# Altium schematic sheet 03-Connectors.SchDoc
size A; DocumentNumber: 4; SheetNumber: 4; SheetTotal: 4
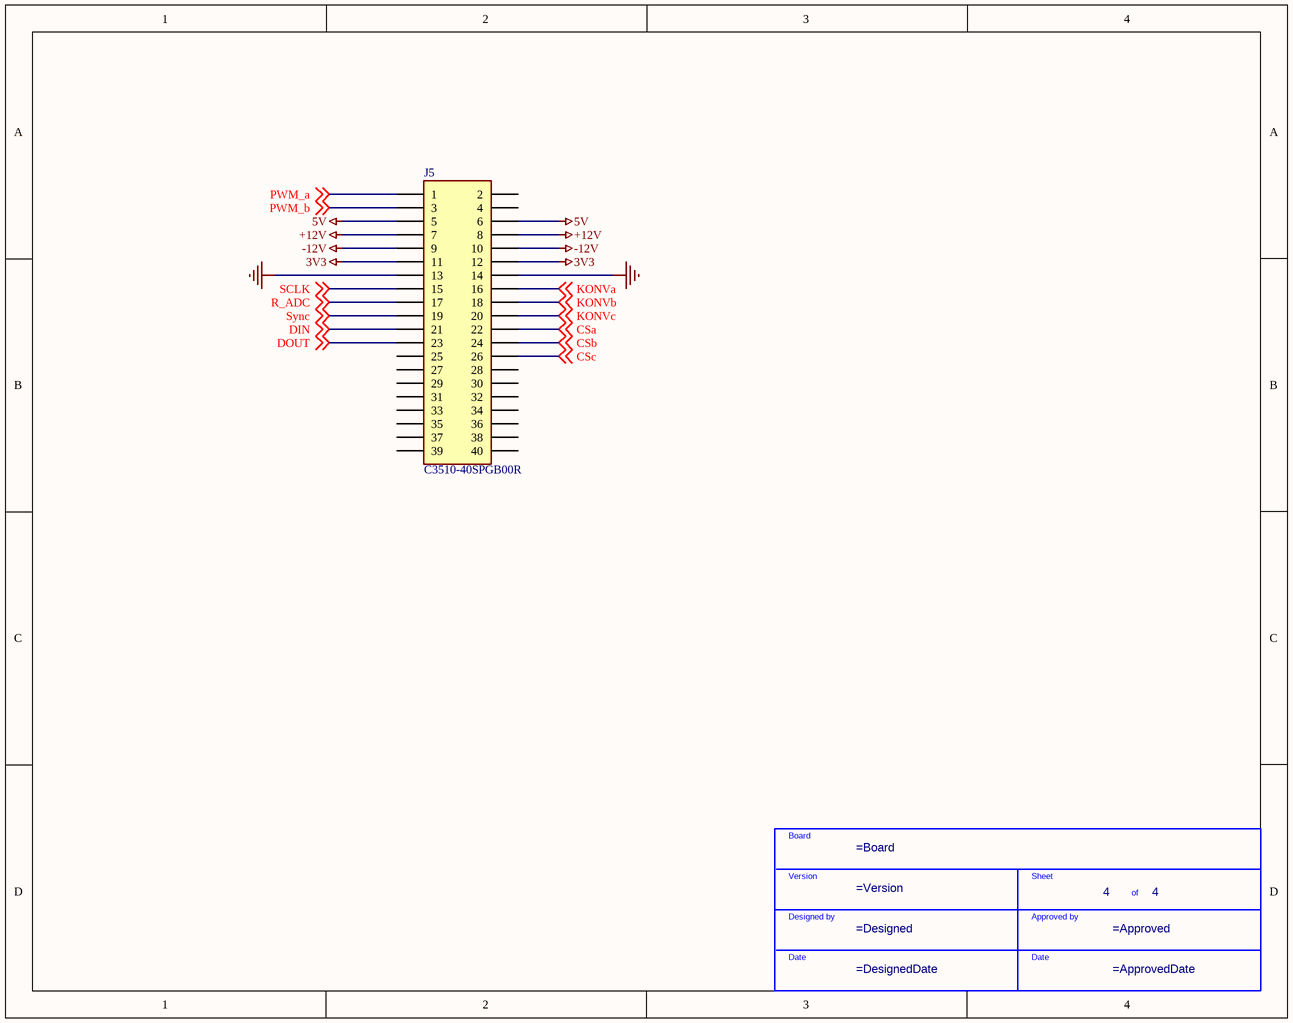
[diagram p0: 03-Connectors.SchDoc]

## Parts
J5  C3510-40SPGB00R  [CONN2X20_MOLEX]
STB  -  (value not drawn)  (graphical)

## Nets
3V3: J5.11 J5.12
5V: J5.5 J5.6
+12V: J5.7 J5.8
-12V: J5.9 J5.10
P_GND: J5.13 J5.14
CSa: J5.22 ; off-sheet CSa
CSb: J5.24 ; off-sheet CSb
CSc: J5.26 ; off-sheet CSc
DIN: J5.21 ; off-sheet DIN
DOUT: J5.23 ; off-sheet DOUT
KONVa: J5.16 ; off-sheet KONVa
KONVb: J5.18 ; off-sheet KONVb
KONVc: J5.20 ; off-sheet KONVc
PWM_a: J5.1 ; off-sheet PWM_a
PWM_b: J5.3 ; off-sheet PWM_b
R_ADC: J5.17 ; off-sheet R_ADC
SCLK: J5.15 ; off-sheet SCLK
Sync: J5.19 ; off-sheet Sync

Not connected (* = marked no-connect by the designer): J5 2 4 25 27 28 29 30 31 32 33 34 35 36 37 38 39 40

## Notes on the sheet
- (in symbol Schematic Title Block) Board; Version; Sheet; of; Designed by; Approved by; Date

## Library data of the parts
J5 = C3510-40SPGB00R: CONN2X20 IDC MALE; Manufacturer: Hsuan Mao Technology; Current Rating: 3A; Pitch: 2.54mm; Supplier 1: Elfa; Manufacturer Part Number: C3510-40SPGB00R; Stock 1: 2061; Pricing 1: 1 = 1.11000, 50 = 0.87000, 100 = 0.64000 (EUR); Contact Material: Gold; Housing Material: Thermoplastic; Contact Gender: Male; ComponentLink1URL: https://datasheet.ciiva.com/14156/04315503-14156870.pdf?src-supplier=Distrelec; ComponentLink1Description: Datasheet; Supplier Part Number 1: 14315560; Type: THT
STB = Schematic Title Block: Schematic Title Block Template